# EAGLE schematic Input sensing circuit (EAGLE 6.5.0)
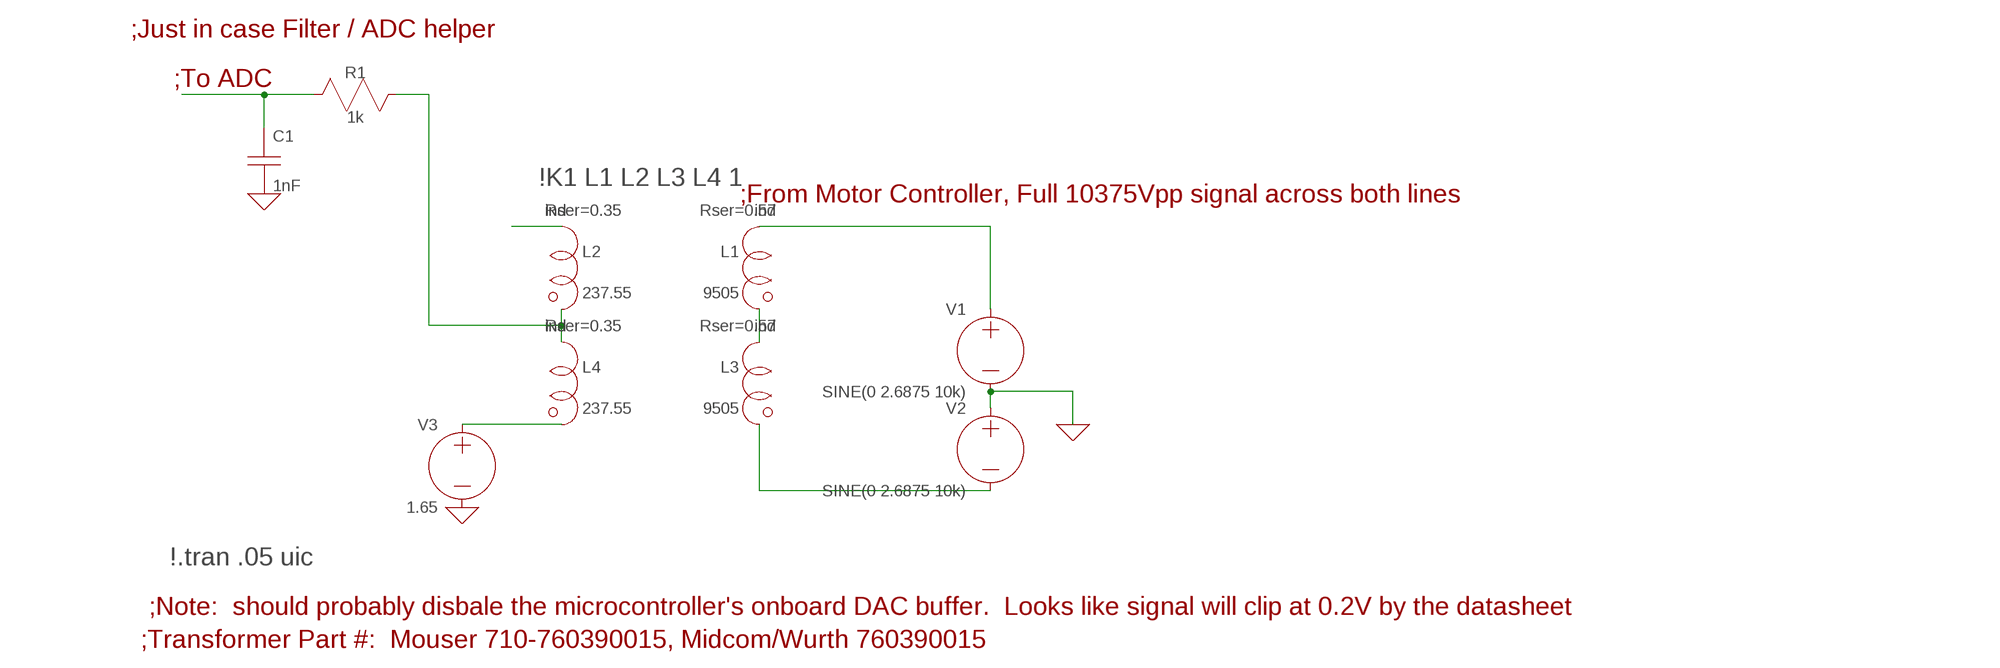
[diagram p0: schematic, sheet 1]

## Parts
C1  1nF  CAP  [C0805]
L1  9505  IND2  [L1812]
L2  237.55  IND2  [L1812]
L3  9505  IND2  [L1812]
L4  237.55  IND2  [L1812]
R1  1k  RES  [R0805]
V1  SINE(0 2.6875 10k)  VOLTAGE  (no package)
V2  SINE(0 2.6875 10k)  VOLTAGE  (no package)
V3  1.65  VOLTAGE  (no package)

## Nets
0: C1.2(B) V1.- V2.+ V3.-
N$1: C1.1(A) R1.2(B)
N$3: L2.1(A)
N$4: L1.1(A) V1.+
N$5: L2.2(B) L4.1(A) R1.1(A)
N$6: L1.2(B) L3.1(A)
N$8: L4.2(B) V3.+
N$9: L3.2(B) V2.-

## Notes on the sheet
- ;Just in case Filter / ADC helper
- ;To ADC
- \!K1 L1 L2 L3 L4 1
- ;From Motor Controller, Full 10375Vpp signal across both lines
- \!.tran .05 uic
- ;Note:  should probably disbale the microcontroller's onboard DAC buffer.  Looks like signal will clip at 0.2V by the datasheet
- ;Transformer Part #:  Mouser 710-760390015, Midcom/Wurth 760390015

## Library data of the parts
C1 = sym:CAP: Capacitor
L1 L3 = sym:IND2: Inductor; SPICELINE: Rser=0.57; SPICETYPE: ind
L2 L4 = sym:IND2: Inductor; SPICELINE: Rser=0.35; SPICETYPE: ind
R1 = sym:RES: A resistor
V1-V3 = lt-spice-simulation:VOLTAGE: Voltage Source, either DC, AC, PULSE, SINE, PWL, EXP, or SFFM